# Altium schematic sheet switch_and_PA.SchDoc
size A
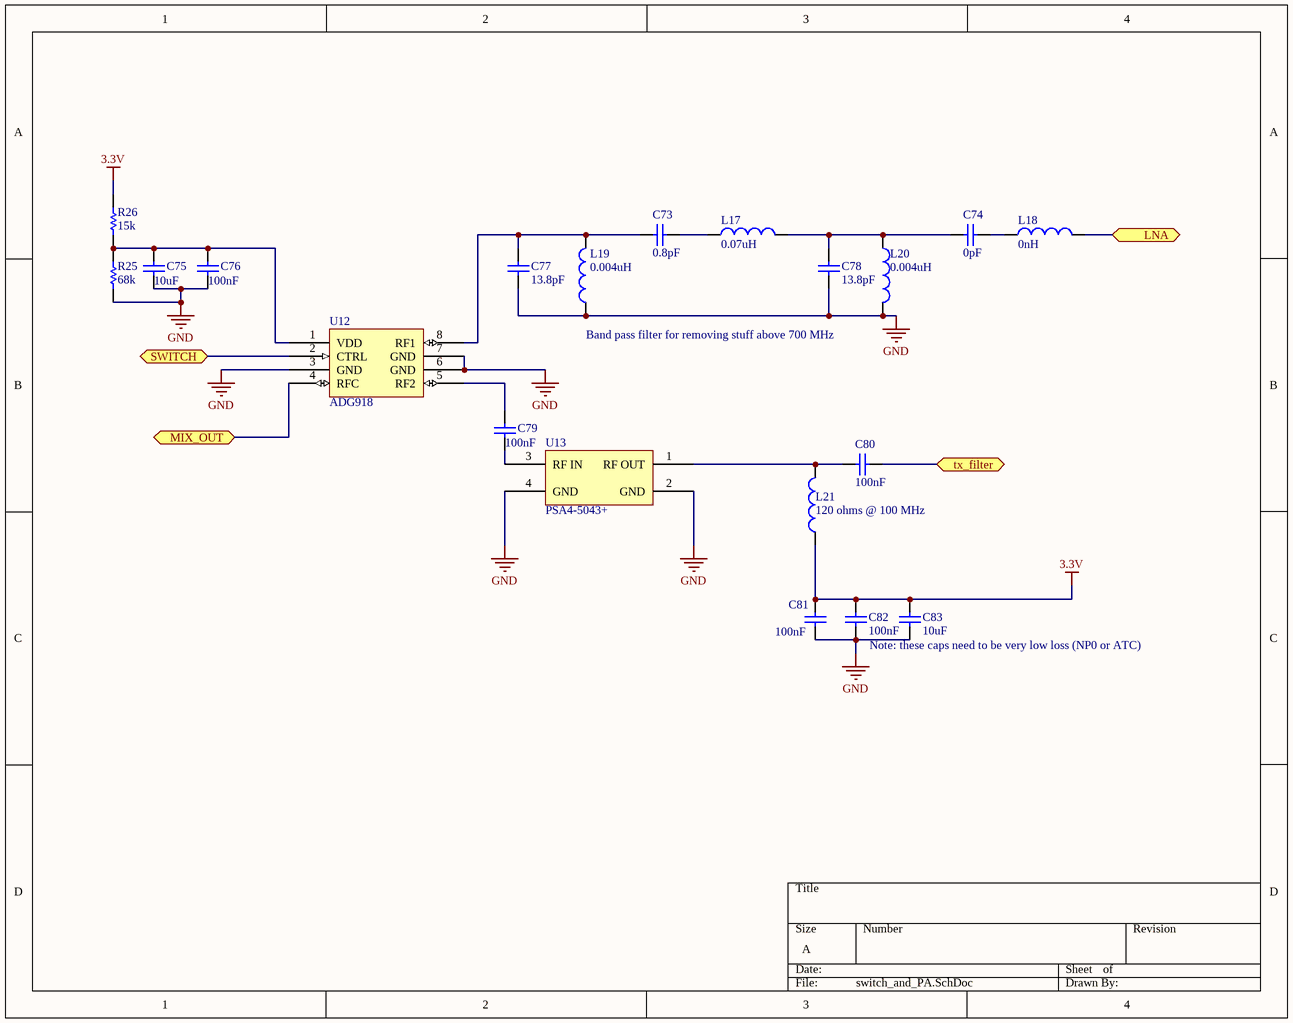
[diagram p0: switch_and_PA.SchDoc]

## Parts
C73  value 0.8pF  [0402]  (hidden comment: Cap Semi)
C74  value 0pF  [0402]  (hidden comment: Cap Semi)
C75  value 10uF  [0402]  (hidden comment: Cap Semi)
C76  value 100nF  [0402]  (hidden comment: Cap Semi)
C77  value 13.8pF  [0402]  (hidden comment: Cap Semi)
C78  value 13.8pF  [0402]  (hidden comment: Cap Semi)
C79  value 100nF  [0402]  (hidden comment: Cap Semi)
C80  value 100nF  [0402]  (hidden comment: Cap Semi)
C81  value 100nF  [0402]  (hidden comment: Cap Semi)
C82  value 100nF  [0402]  (hidden comment: Cap Semi)
C83  value 10uF  [0402]  (hidden comment: Cap Semi)
L17  value 0.07uH  [0402]  (hidden comment: Inductor)
L18  value 0nH  [0402]  (hidden comment: Inductor)
L19  value 0.004uH  [0402]  (hidden comment: Inductor)
L20  value 0.004uH  [0402]  (hidden comment: Inductor)
L21  value 120 ohms @ 100 MHz  [0402]  (hidden comment: Inductor)
R25  value 68k  [0402]  (hidden comment: Res Semi)
R26  value 15k  [0402]  (hidden comment: Res Semi)
U12  ADG918  [ADG918]
U13  PSA4-5043+

## Ports
LNA, MIX_OUT, SWITCH, tx_filter

## Nets
3.3V: C81.1 C82.1 C83.1 L21.1 R26.1
GND: C75.1 C76.1 C77.2 C78.2 C81.2 C82.2 C83.2 L19.1 L20.2 R25.2 U12.3(GND) U12.6(GND) U12.7(GND) U13.2(GND) U13.4(GND)
LNA: L18.2 ; port LNA
MIX_OUT: U12.4(RFC) ; port MIX_OUT
SWITCH: U12.2(CTRL) ; port SWITCH
tx_filter: C80.1 ; port tx_filter
NetC73_1: C73.1 L17.1
NetC73_2: C73.2 C77.1 L19.2 U12.8(RF1)
NetC74_1: C74.1 L18.1
NetC74_2: C74.2 C78.1 L17.2 L20.1
NetC75_2: C75.2 C76.2 R25.1 R26.2 U12.1(VDD)
NetC79_1: C79.1 U13.3(RF_IN)
NetC79_2: C79.2 U12.5(RF2)
NetC80_2: C80.2 L21.2 U13.1(RF_OUT)

## Notes on the sheet
- Band pass filter for removing stuff above 700 MHz
- Note: these caps need to be very low loss (NP0 or ATC)

## Library data of the parts
C73-C83 = Cap Semi: Capacitor (Semiconductor SIM Model); Published: 8-Jun-2000; LatestRevisionDate: 29-May-2009; LatestRevisionNote: IPC-7351 Footprint Added.; PackageReference: C1206; Publisher: Altium Limited; PackageDescription: Chip Capacitor
L17-L21 = Inductor: Code_IEC: 1005; Published: 8-Jun-2000; LatestRevisionDate: 29-May-2009; LatestRevisionNote: IPC-7351 Footprint Added.; PackageReference: 0402-A; Publisher: Altium Limited; PackageDescription: Chip Inductor; Code_JEITA: 0402
R25 R26 = Res Semi: Semiconductor Resistor; Published: 8-Jun-2000; LatestRevisionDate: 17-Jul-2002; LatestRevisionNote: Re-released for DXP Platform.; PackageReference: AXIAL-0.5; Publisher: Altium Limited; PackageDescription: Axial Device, Thru-Hole; 2 Leads; 0.5 in Pin Spacing
U12 = ADG918: RF Switch; Manufacturer: Analog Devices Inc; Manufacturer Part Number: ADG918BRMZ; Description: IC SW ONE HS SPDT 1.6/2.7V 8MSOP; RF Type: General Purpose; Frequency: 0Hz ~ 2GHz; ComponentLink1URL: http://www.analog.com/static/imported-files/data_sheets/ADG918_919.pdf; ComponentLink1Description: Datasheet for ADG918; Supplier 1: Digi-Key; RoHS: RoHS Compliant; Category: RF/IF and RFID; Stock 1: 5696; Pricing 1: 1=2.75, 10=2.453, 25=2.2072, 100=2.0111, 250=1.81484, 500=1.62846, 1000=1.3734, 2500=1.308 (USD); Features: SPDT; Package / Case: 8-TSSOP, 8-MSOP (0.118", 3.00mm Width); Supplier Device Package: 8-MSOP; Packaging: Tube; Supplier Part Number 1: ADG918BRMZ-ND
U13 = PSA4-5043+: LNA